# EAGLE schematic Charging Tractive System Schematic (EAGLE 9.6.2)
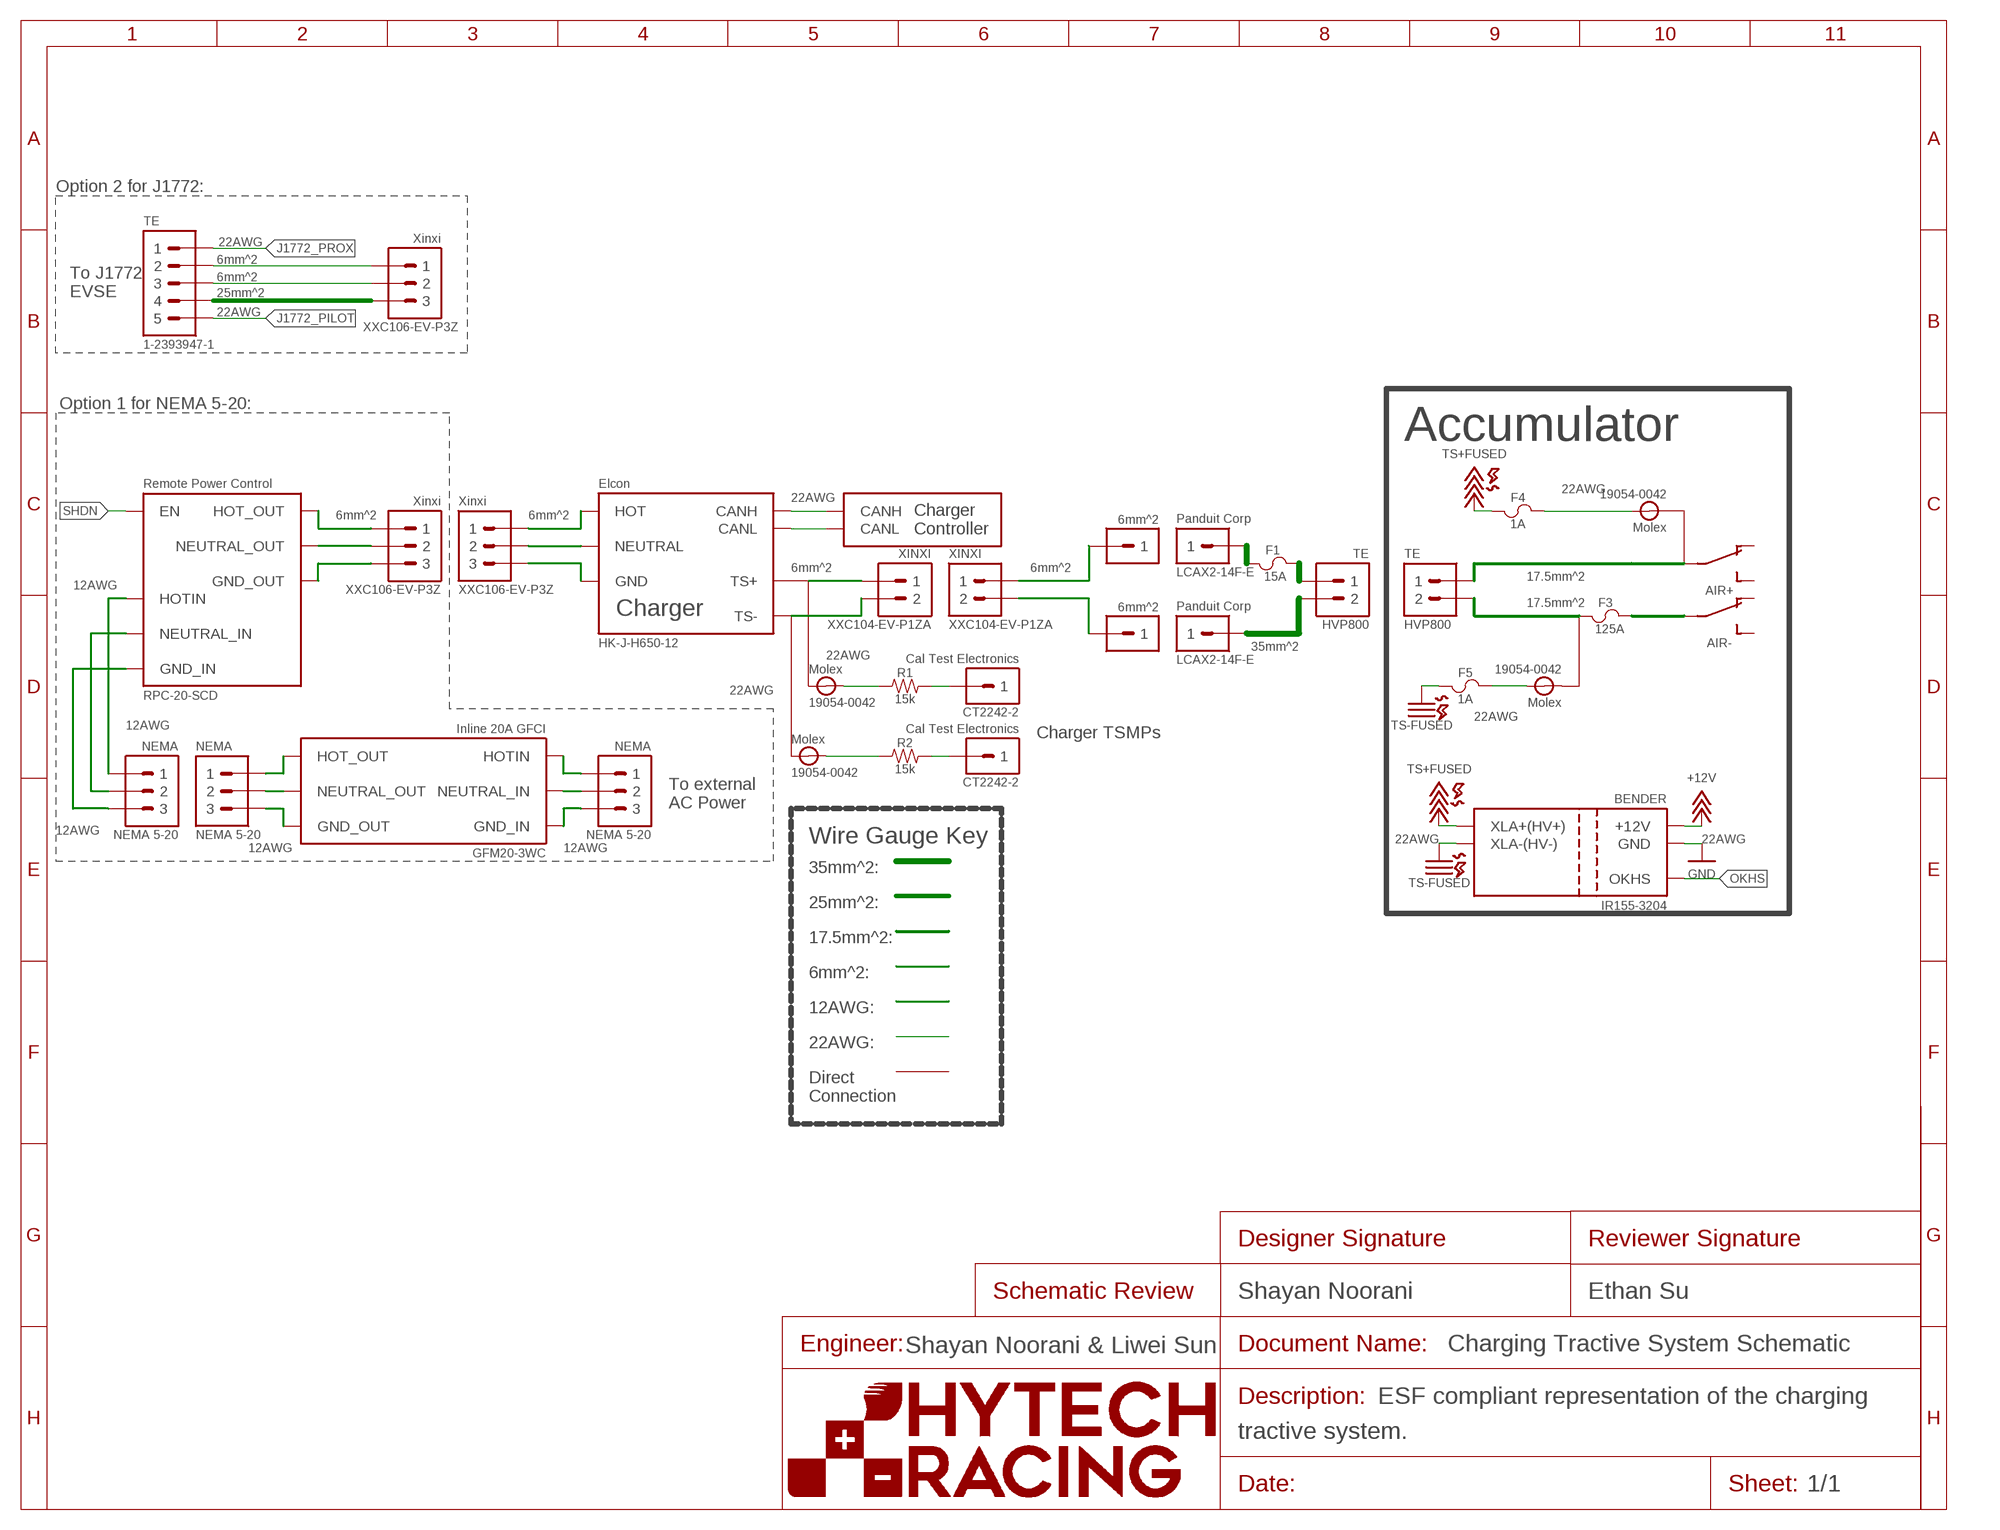
[diagram p0: schematic, sheet 1]
U$2 (FRAME_SCHEMATIC_ONLY): DESCRIPTION_1: ESF compliant representation of the charging; DESCRIPTION_2: tractive system.; DESIGNER_SCHEMATIC: Shayan Noorani; ENGINEER: Shayan Noorani & Liwei Sun; REVIEWER_SCHEMATIC: Ethan Su

## Parts
A1  REMOTE_POWER_CONTROL_RPC-20-SCD  (no package)
A2  CHARGER_HK-J-H650-12  (no package)
A3  INLINE_GFCI_GFM20-3WC  (no package)
F1  1A  FUSE  (no package)
F3  175A  FUSE  (no package)
F4  1A  FUSE  (no package)
F5  1A  FUSE  (no package)
J1  CONNECTOR-1_6MM2  (no package)
J2  CONNECTOR-1_LCAX2-14F-E  (no package)
J3  CONNECTOR-1_6MM2  (no package)
J4  CONNECTOR-1_LCAX2-14F-E  (no package)
J5  CONNECTOR-3_XXC106-EV-P3Z  (no package)
J6  RING_TERMINAL_19054-0042  (no package)
J7  RING_TERMINAL_19054-0042  (no package)
J8  CONNECTOR-3_NEMA-5-20  (no package)
J9  CONNECTOR-1_CT2242-2  (no package)
J10  CONNECTOR-1_CT2242-2  (no package)
J11  CONNECTOR-5_1-2393947-1  (no package)
J12  CONNECTOR-3_XXC106-EV-P3Z  (no package)
J15  CONNECTOR-3_NEMA-5-20  (no package)
J16  CONNECTOR-3_NEMA-5-20  (no package)
J17  CONNECTOR-2_  CONNECTOR-2_XXC104-EV-P1ZA  (no package)
J18  CONNECTOR-2_  CONNECTOR-2_XXC104-EV-P1ZA  (no package)
R1  15k  RESISTOR  (no package)
R2  15k  RESISTOR  (no package)
S1  SWITCH_SPST_  (no package)
S2  SWITCH_SPST_  (no package)
U$1  CONNECTOR-2_HVP800  (no package)
U$3  CONNECTOR-3_XXC106-EV-P3Z  (no package)
U$4  CONNECTOR-2_HVP800  (no package)
U$5  BENDER_IR155-3204  (no package)
U$6  RING_TERMINAL_19054-0042  (no package)
U$7  RING_TERMINAL_19054-0042  (no package)
U$15  CHARGER_CONTROLLER  (no package)

## Nets
15A: F1.2 U$4.1
+12V: U$5.+12V
CHARGER_CONTROLLER_CANH: A2.CANH U$15.CANH
CHARGER_CONTROLLER_CANL: A2.CANL U$15.CANL
GND: U$5.GND
J1772_PILOT: J11.5
J1772_PROX: J11.1
N$1: A2.NEUTRAL U$3.2
N$2: A2.GND U$3.3
N$3: A2.HOT U$3.1
N$4: J17.1
N$5: A2.TS- J17.2
N$6: A1.HOT_OUT J5.1
N$7: A1.NEUTRAL_OUT J5.2
N$8: J9.1 R1.2
N$9: J10.1 R2.2
N$10: S1.P U$1.1
N$11: F3.1 U$1.2
N$12: J11.2 J12.1
N$14: J1.1 J18.1
N$15: J3.1 J18.2
N$19: A1.GND_OUT J5.3
N$20: J4.1 U$4.2
N$22: A1.HOTIN J15.1
N$23: A3.NEUTRAL_OUT J8.2
N$24: A1.NEUTRAL_IN J15.2
N$25: R1.1 U$7.P$2
N$26: F5.2 J7.P$2
N$27: R2.1 U$6.P$2
N$28: A3.HOT_OUT J8.1
N$29: A3.GND_OUT J8.3
N$30: A3.GND_IN J16.3
N$31: A3.NEUTRAL_IN J16.2
N$32: A3.HOTIN J16.1
N$33: A1.GND_IN J15.3
N$35: F4.2 J6.P$2
N$36: F3.2 S2.P
N$37: J11.3 J12.2
N$39: J11.4 J12.3
N$40: F1.1 J2.1
OKHS: U$5.OKHS
SHDN: A1.EN
TS+: F4.1 U$5.XLA+(HV+) ; supply symbol labelled TS+FUSED
TS-UNFUSED: F5.1 U$5.XLA-(HV-) ; supply symbol labelled TS-FUSED
Unconnected: A2.TS+ J6.P$1 J7.P$1 S1.O S1.S S2.O S2.S U$6.P$1 U$7.P$1

## Notes on the sheet
- Option 2 for J1772:
- 22AWG
- 6mm^2
- 6mm^2
- 25mm^2
- To J1772 
  EVSE
- 22AWG
- Option 1 for NEMA 5-20: | Accumulator
- 22AWG | 22AWG
- 6mm^2 | 6mm^2
- 6mm^2 | 6mm^2
- 12AWG | 17.5mm^2
- 17.5mm^2
- 125A
- 35mm^2
- 22AWG
- 22AWG
- 12AWG | 22AWG
- Charger TSMPs
- To external 
  AC Power
- 12AWG | Wire Gauge Key
- 12AWG | 12AWG | 22AWG | 22AWG
- 35mm^2:
- 25mm^2:
- 17.5mm^2:
- 6mm^2:
- 12AWG:
- 22AWG:
- Direct
  Connection

## Library data of the parts
A1 = HyTechSymbolsTemp:REMOTE_POWER_CONTROL_*: Remote power control RPC-20-SCD <https://www.lowellmfg.com/wp-content/uploads/1230-RPC20SCD.pdf>; MANUFACTURER: Lowell Manufacturing; MPN: RPC-20-SCD
A2 = HyTechSymbols:CHARGER_*: OVARTECH Charger <http://www.ovartech.com/wp-content/uploads/2017/12/Ovartech-Liquid-cooled-6.6KW-OBC1.5KW-DCDC-CAD662DF400-12152-Data-Sheet.pdf> Cascadia Motion Charger <https://app.box.com/s/mekevo8krrefqodui59qanzvkyfg6lnt>; MANUFACTURER: Elcon; MPN: HK-J-H650-12
A3 = HyTechSymbolsTemp:INLINE_GFCI_*: Inline GFCI GFM20-3WC <https://www.leviton.com/en/docs/Portable_GFCI_Devices_PB_Q-315E.pdf>; MANFUACTURER: Leviton; MPN: GFM20-3WC
F1 = HyTechSymbolsTemp:FUSE; _EXTERNAL_: 15A
F3 = HyTechSymbolsTemp:FUSE; _EXTERNAL_: 125A
F4 F5 = HyTechSymbolsTemp:FUSE
J1 J3 = HyTechSymbols:CONNECTOR-1_*: Single pin connector CT2242-2 <https://drive.google.com/file/d/1rFz1F44pFGMLks1TuzNftb-wQBk0xWUD/view> LCAX2-14F-E <https://drive.google.com/file/d/1bbvHAAOUtBwm4fAPUWES_iBsARNVuAgN/view>; MPN: 6mm^2
J2 J4 = HyTechSymbols:CONNECTOR-1_*: Single pin connector CT2242-2 <https://drive.google.com/file/d/1rFz1F44pFGMLks1TuzNftb-wQBk0xWUD/view> LCAX2-14F-E <https://drive.google.com/file/d/1bbvHAAOUtBwm4fAPUWES_iBsARNVuAgN/view>; MANUFACTURER: Panduit Corp; MPN: LCAX2-14F-E
J5 J12 U$3 = HyTechSymbols:CONNECTOR-3_*: Three pin connector XXC106-EV-P3Z <https://drive.google.com/file/d/1qR1Rhcju7C1tSf9gvk0xHmD0lfie2p2O/view?usp=sharing> HV02-M3S(40A)-M00A-1 <https://drive.google.com/file/d/14-0BdluqhzWVuxobIuHQclYd8S9S8AFy/view> NEMA-5-20 <https://drive.google.com/file/d/1QyRJhkZq4Jge6F64jD-5aG-LjfEdAoZD/view>; MANUFACTURER: Xinxi; MPN: XXC106-EV-P3Z
J6 J7 = HyTechSymbols:RING_TERMINAL_*: Ring terminal 19054-0042 <https://drive.google.com/drive/folders/1JhKTbRtwaszOvYIb3y-YkBSe0CyrUopM>; MANUFACTURER: Molex; MPN: 19054-0042
J8 J15 J16 = HyTechSymbolsTemp:CONNECTOR-3_*: Three pin connector HV02-M3S(40A)-M00A-1 <https://drive.google.com/file/d/14-0BdluqhzWVuxobIuHQclYd8S9S8AFy/view> NEMA-5-20 <https://drive.google.com/file/d/1QyRJhkZq4Jge6F64jD-5aG-LjfEdAoZD/view>; MANUFACTURER: NEMA; MPN: NEMA 5-20
J9 J10 = HyTechSymbolsTemp:CONNECTOR-1_*: Single pin connector CT2242-2 <https://drive.google.com/file/d/1rFz1F44pFGMLks1TuzNftb-wQBk0xWUD/view> LCAX2-14F-E <https://drive.google.com/file/d/1bbvHAAOUtBwm4fAPUWES_iBsARNVuAgN/view>; MANUFACTURER: Cal Test Electronics; MPN: CT2242-2
J11 = HyTechSymbols:CONNECTOR-5_*: Five pin connector Micro-Fit 3.0 <https://drive.google.com/file/d/1Be8WGxzm3IeOWSN4qfSP8J4bwHUWCwaO/view>; MANUFACTURER: TE; MPN: 1-2393947-1
J17 J18 = HyTechSymbols:CONNECTOR-2_*: Two pin connector EVH2-N2TK-TDA <https://drive.google.com/file/d/1gQfuywpa-Tm7bohh-tcSjjxbyqcnD_h9/view> HPK <https://drive.google.com/file/d/1jTQMZ26zoHotHQHZYMoMT2jUzRt664sO/view> HVP800 <https://drive.google.com/file/d/1j-HswfqYHj8usJ9E3bf8NWBzB-X0BKJ4/view>; MANUFACTURER: XINXI; MPN: XXC104-EV-P1ZA
R1 R2 = HyTechSymbolsTemp:RESISTOR
S1 = HyTechSymbols:SWITCH_SPST_*: Single Pull Single Throw Switch EAO Series 61 27mm Illuminated Emergency Stop Swtich <https://eao.com/fileadmin/documents/PDFs/en/03_brochures/EAO_PB_61_E-Stop_Compact_EN.pdf> EAO Series 45 40mm Illuminated Emergency Stop Swtich <https://hmi.eao.com/p/965f6719> EAO Series 45 34mm Illuminated Emergency Stop Switch <https://hmi.eao.com/p/5909b34f> TE Battery Disconnector Switch <https://www.mouser.com/datasheet/2/418/8/ENG_CD_35_210_100_R_900_5-2533843.pdf>; MPN: AIR+
S2 = HyTechSymbols:SWITCH_SPST_*: Single Pull Single Throw Switch EAO Series 61 27mm Illuminated Emergency Stop Swtich <https://eao.com/fileadmin/documents/PDFs/en/03_brochures/EAO_PB_61_E-Stop_Compact_EN.pdf> EAO Series 45 40mm Illuminated Emergency Stop Swtich <https://hmi.eao.com/p/965f6719> EAO Series 45 34mm Illuminated Emergency Stop Switch <https://hmi.eao.com/p/5909b34f> TE Battery Disconnector Switch <https://www.mouser.com/datasheet/2/418/8/ENG_CD_35_210_100_R_900_5-2533843.pdf>; MPN: AIR-
U$1 U$4 = HyTechSymbols:CONNECTOR-2_*: Two pin connector EVH2-N2TK-TDA <https://drive.google.com/file/d/1gQfuywpa-Tm7bohh-tcSjjxbyqcnD_h9/view> HPK <https://drive.google.com/file/d/1jTQMZ26zoHotHQHZYMoMT2jUzRt664sO/view> HVP800 <https://drive.google.com/file/d/1j-HswfqYHj8usJ9E3bf8NWBzB-X0BKJ4/view>; MANUFACTURER: TE; MPN: HVP800
U$5 = HyTechSymbols:BENDER_IR155-3204: Bender IR155-3204 Insulation Monitoring Device Datasheet <http://www.bender-es.com/fileadmin/products/doc/IR155-32xx-V004_D00115_D_XXEN.pdf>
U$6 U$7 = HyTechSymbolsTemp:RING_TERMINAL_*: Ring terminal 19054-0042 <https://drive.google.com/drive/folders/1JhKTbRtwaszOvYIb3y-YkBSe0CyrUopM>; MANUFACTURER: Molex; MPN: 19054-0042
U$15 = HyTechSymbolsTemp:CHARGER_CONTROLLER: Block representation of the charger controller.